# EAGLE design PhatStats Slim Enclosure ESP PCB v0.96 (EAGLE 7.6.0)
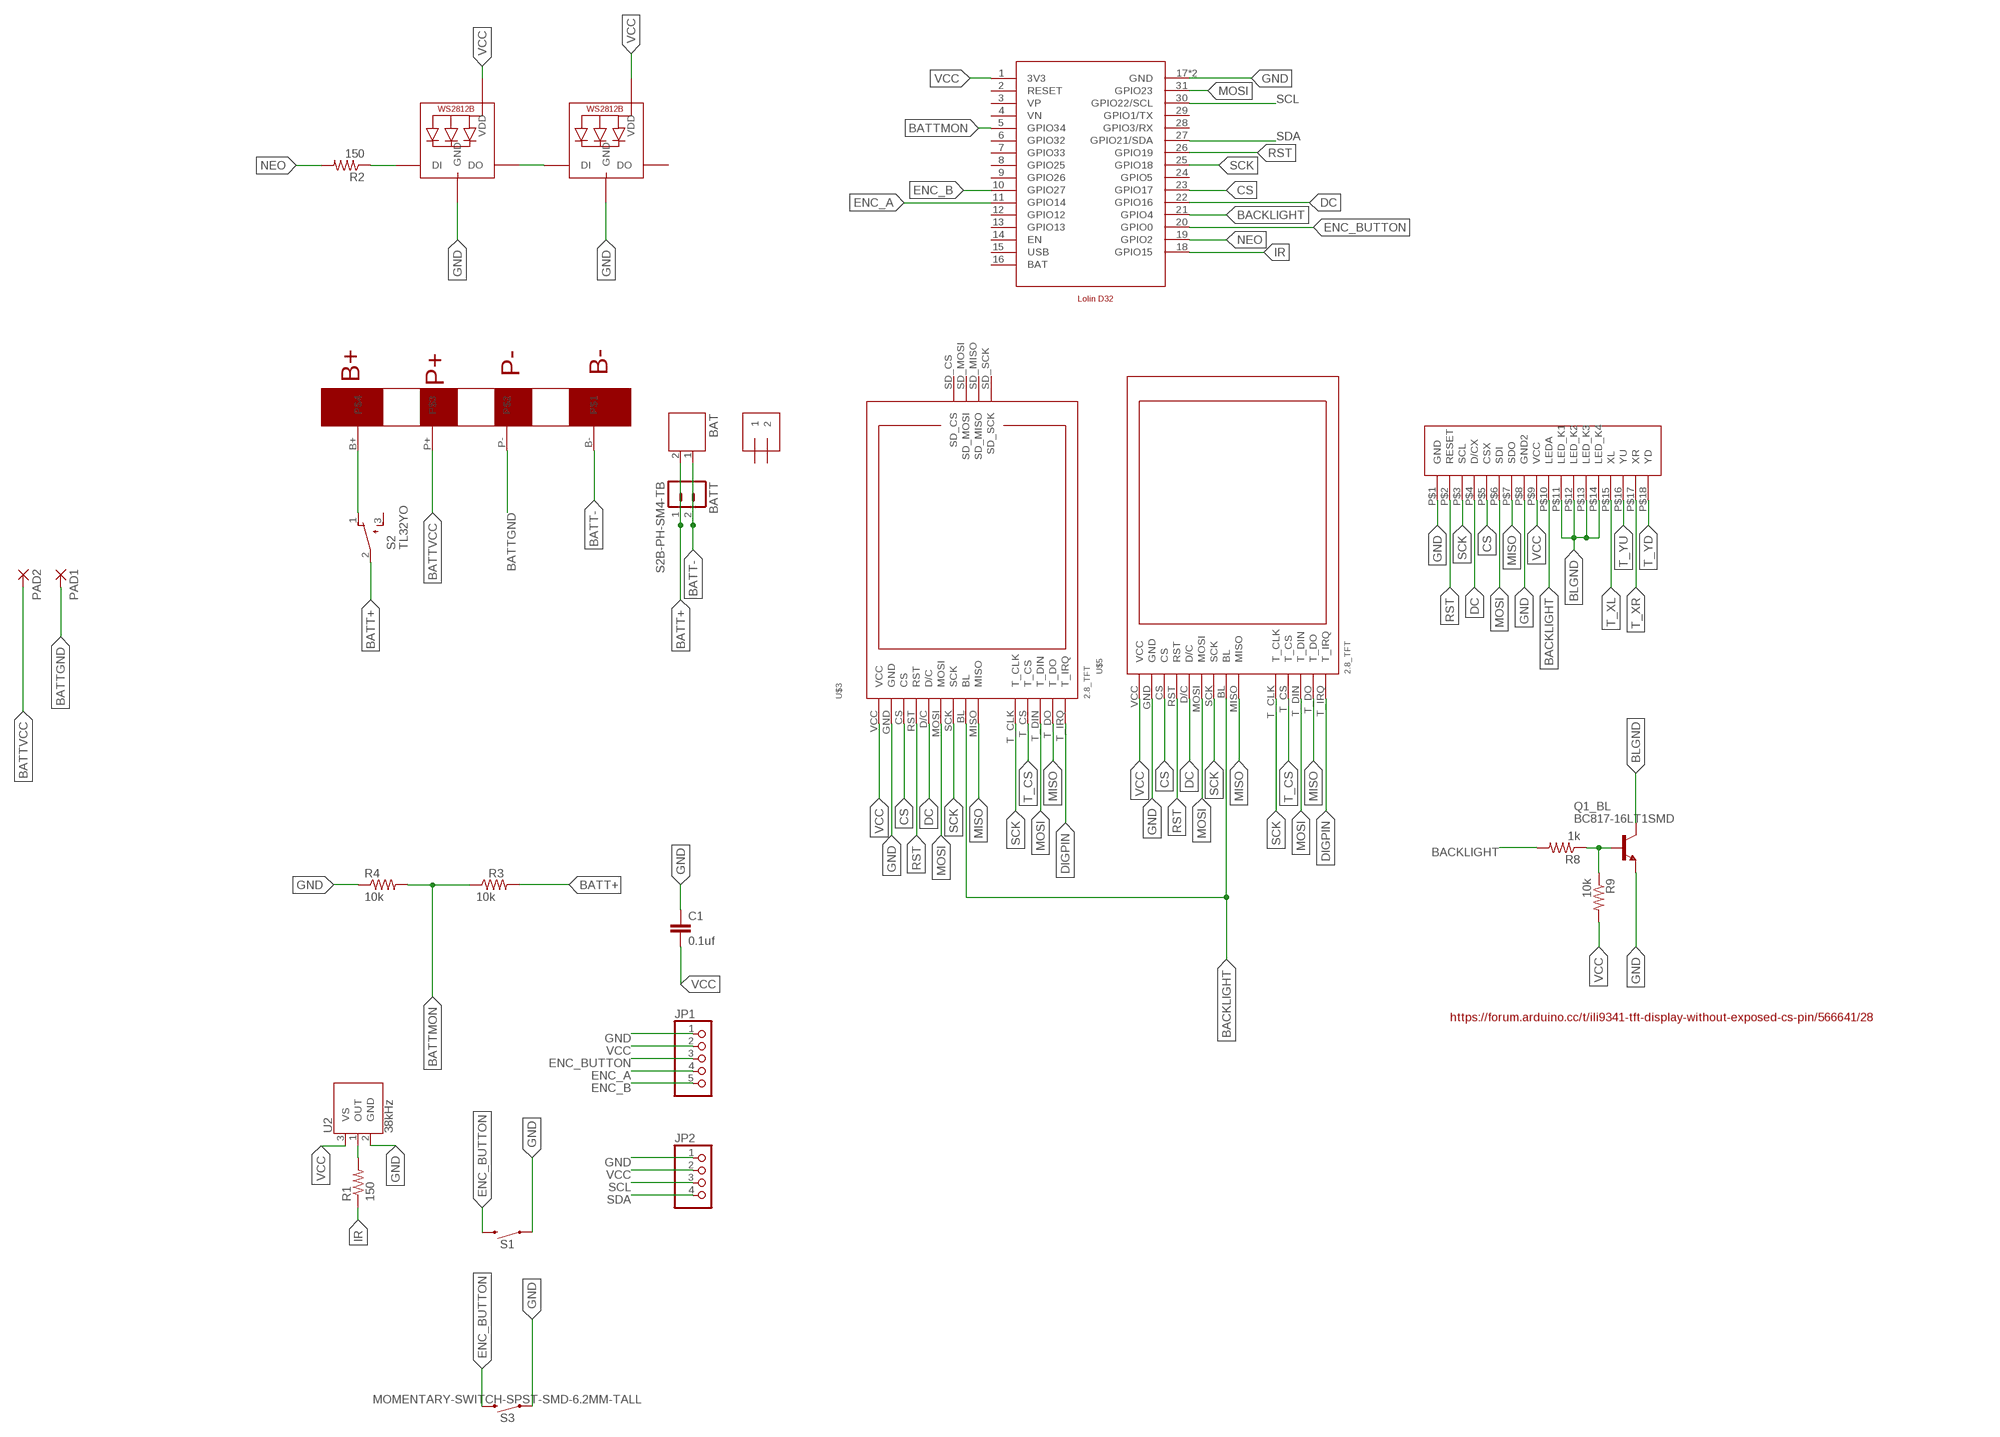
[diagram p0: schematic, sheet 1]

## Parts
0  ILI9341-2.8  [ILI9341-2.8]
BAT  JST-PH2  [JST-PH2]
BATT  S2B-PH-SM4-TB  [S2B-PH-SM4-TB]
BMS  DW01BATTERYPROT  [DW01BATTERYPROT]
C1  0.1uf  C-EUC1206  [C1206]
J1  1X2-3.5MM  [1X2-3.5MM]
JP1  PINHD-1X5  [1X05]
JP2  PINHD-1X4  [1X04]
NEO1  WS2812B5050  [WS2812B]
NEO2  WS2812B5050  [WS2812B]
PAD1  WIREPADSMD5-1,8  [5-1,8]
PAD2  WIREPADSMD5-1,8  [5-1,8]
Q1_BL  BC817-16LT1SMD  [SOT23-BEC]
R1  150  R-US_M1206  [M1206]
R2  150  R-US_M1206  [M1206]
R3  10k  R-US_M1206  [M1206]
R4  10k  R-US_M1206  [M1206]
R8  1k  R-US_M1206  [M1206]
R9  10k  R-US_M1206  [M1206]
S1  MOMENTARY-SWITCH-SPST-PTH-6.0MM  [TACTILE_SWITCH_PTH_6.0MM]
S2  TL32YO  [TL3XYO]
S3  MOMENTARY-SWITCH-SPST-SMD-6.2MM-TALL  [TACTILE_SWITCH_SMD_6.2MM_TALL]
U2  38kHz  TSOP38238  [TSOP382]
U$2  LOLIND32  [LOLIND32]
U$3  2.8_TFT  [2.8_TFT]
U$5  2.8_TFT  [2.8_TFT]

## Nets
BACKLIGHT: 0.P$10(LEDA) R8.2 U$2.21(GPIO4) U$3.BL U$5.BL
BATT+: BAT.2 BATT.1 R3.2 S2.2(P)
BATT-: BAT.1 BATT.2 BMS.B-
BATTGND: BMS.P- PAD1.1(P)
BATTMON: R3.1 R4.2 U$2.5(GPIO34)
BATTVCC: BMS.P+ PAD2.1(P)
BLGND: 0.P$11(LED_K1) 0.P$12(LED_K2) 0.P$13(LED_K3) 0.P$14(LED_K4) Q1_BL.C
CS: 0.P$5(CSX) U$2.23(GPIO17) U$3.CS U$5.CS
DC: 0.P$4(D/CX) U$2.22(GPIO16) U$3.D/C U$5.D/C
DIGPIN: U$3.T_IRQ U$5.T_IRQ
ENC_A: JP1.4 U$2.11(GPIO14)
ENC_B: JP1.5 U$2.10(GPIO27)
ENC_BUTTON: JP1.3 S1.3 S3.B2 U$2.20(GPIO0)
GND: 0.P$1(GND) 0.P$8(GND2) C1.1 JP1.1 JP2.1 NEO1.3-GND(GND) NEO2.3-GND(GND) Q1_BL.E R4.1 S1.1 S3.A2 U2.2(GND) U$2.17(GND) U$2.32(GND) U$3.GND U$5.GND
IR: R1.1 U$2.18(GPIO15)
MISO: 0.P$7(SDO) U$3.MISO U$3.T_DO U$5.MISO U$5.T_DO
MOSI: 0.P$6(SDI) U$2.31(GPIO23) U$3.MOSI U$3.T_DIN U$5.MOSI U$5.T_DIN
N$1: BMS.B+ S2.1(O)
N$2: NEO1.2-DOUT(DO) NEO2.4-DIN(DI)
N$3: R1.2 U2.1(OUT)
N$4: NEO1.4-DIN(DI) R2.1
N$7: Q1_BL.B R8.1 R9.1
NEO: R2.2 U$2.19(GPIO2)
RST: 0.P$2(RESET) U$2.26(GPIO19) U$3.RST U$5.RST
SCK: 0.P$3(SCL) U$2.25(GPIO18) U$3.SCK U$3.T_CLK U$5.SCK U$5.T_CLK
SCL: JP2.3 U$2.30(GPIO22/SCL)
SDA: JP2.4 U$2.27(GPIO21/SDA)
T_CS: U$3.T_CS U$5.T_CS
T_XL: 0.P$15(XL)
T_XR: 0.P$17(XR)
T_YD: 0.P$18(YD)
T_YU: 0.P$16(YU)
VCC: 0.P$9(VCC) C1.2 JP1.2 JP2.2 NEO1.1-VDD(VDD) NEO2.1-VDD(VDD) R9.2 U2.3(VS) U$2.1(3V3) U$3.VCC U$5.VCC
Unconnected: J1.1 J1.2 NEO2.2-DOUT(DO) S2.3(S) U$2.2(RESET) U$2.3(VP) U$2.4(VN) U$2.6(GPIO32) U$2.7(GPIO33) U$2.8(GPIO25) U$2.9(GPIO26) U$2.12(GPIO12) U$2.13(GPIO13) U$2.14(EN) U$2.24(GPIO5) U$2.28(GPIO3/RX) U$2.29(GPIO1/TX) U$3.SD_CS U$3.SD_MISO U$3.SD_MOSI U$3.SD_SCK

## Notes on the sheet
- https://forum.arduino.cc/t/ili9341-tft-display-without-exposed-cs-pin/566641/28

## Power pins joined to a net without a drawn wire
BAT: U$2.16(BAT)
USB: U$2.15(USB)

## Library data of the parts
0 = TML_ili9341_0.8Pitch_Header:ILI9341-2.8
BAT = jst-ph:JST-PH2
BATT = con-JST PH:S2B-PH: JST PH series header 2.00mm pitch disconnectable crimp style connectors, horizontal (side entry type), 2 pins
BMS = TML_DW01_BatteryProtectionModule2:DW01BATTERYPROT
C1 = rcl:C-EU: CAPACITOR, European symbol; SPICEPREFIX: C
J1 = adafruit:1X2: 3.5mm Terminal block http://www.ladyada.net/library/pcb/eaglelibrary.html
JP1 = pinhead:PINHD-1X5: PIN HEADER
JP2 = pinhead:PINHD-1X4: PIN HEADER
NEO1 NEO2 = adafruit:WS2812B
PAD1 PAD2 = wirepad:WIREPAD: Wire PAD connect wire on PCB
Q1_BL = transistor-npn:BC817*: NPN Transistor
R1-R4 R8 R9 = resistor:R-US_: RESISTOR, American symbol
S1 = SparkFun-Switches:MOMENTARY-SWITCH-SPST: Momentary Switch (Pushbutton) - SPST Normally-open (NO) SPST momentary switches (buttons, pushbuttons). Variants PTH-12MM - 12mm square, through-hole Momentary Pushbutton Switch - 12mm Square <https://www.sparkfun.com/products/9190> (COM-09190) PTH-6.0MM, PTH-6.0MM-KIT - 6.0mm square, through-hole Mini Pushbutton Switch <https://www.sparkfun.com/products/97> (COM-00097) KIT package intended for soldering kit's - only one side of pads' copper is exposed. PTH-RIGHT-ANGLE-KIT - Right-angle, through-hole Right Angle Tactile Button <https://www.sparkfun.com/products/10791> - Used on SparkFun BigTime Watch Kit <https://www.sparkfun.com/products/11734> SMD-12MM - 12mm square, surface-mount Tactile Button - SMD (12mm) <https://www.sparkfun.com/products/12993> (COM-12993) Used on SparkFun PicoBoard <https://www.sparkfun.com/products/11888> SMD-4.5MM - 4.5mm Square Trackball Switch Used on SparkFun Blackberry Trackballer Breakout <https://www.sparkfun.com/products/13169> SMD-4.6MMX2.8MM - 4.60mm x 2.80mm, surface mount Used on SparkFun SAMD21 Mini Breakout <https://www.sparkfun.com/products/13664> SMD-5.2MM, SMD-5.2-REDUNDANT - 5.2mm square, surface-mount Mini Pushbutton Switch - SMD <https://www.sparkfun.com/products/8720> (COM-08720) Used on Arduino Pro Mini <https://www.sparkfun.com/products/11114> REDUNDANT package connects both switch circuits together SMD-6.0X3.5MM - 6.0 x 3.5mm, surface mount Momentary Reset Switch SMD <https://www.sparkfun.com/products/8229> (COM-08229) SMD-6.2MM-TALL - 6.2mm square, surface mount Tactile Button - SMD (6mm) <https://www.sparkfun.com/products/12992> Used on SparkFun Digital Sandbox <https://www.sparkfun.com/products/12651> SMD-RIGHT-ANGLE - Right-angle, surface mount Used on SparkFun Block for Intel® Edison - Arduino <https://www.sparkfun.com/products/13036>; PROD_ID: SWCH-08441; SF_SKU: COM-00097
S2 = switch:TL32YO: TINY SWITCH ON - MOM Source: http://www2.produktinfo.conrad.com/datenblaetter/700000-724999/705152-da-01-de-Subminiaturschalter_TL_36YO.pdf
S3 = SparkFun-Switches:MOMENTARY-SWITCH-SPST: Momentary Switch (Pushbutton) - SPST Normally-open (NO) SPST momentary switches (buttons, pushbuttons). Variants PTH-12MM - 12mm square, through-hole Momentary Pushbutton Switch - 12mm Square <https://www.sparkfun.com/products/9190> (COM-09190) PTH-6.0MM, PTH-6.0MM-KIT - 6.0mm square, through-hole Mini Pushbutton Switch <https://www.sparkfun.com/products/97> (COM-00097) KIT package intended for soldering kit's - only one side of pads' copper is exposed. PTH-RIGHT-ANGLE-KIT - Right-angle, through-hole Right Angle Tactile Button <https://www.sparkfun.com/products/10791> - Used on SparkFun BigTime Watch Kit <https://www.sparkfun.com/products/11734> SMD-12MM - 12mm square, surface-mount Tactile Button - SMD (12mm) <https://www.sparkfun.com/products/12993> (COM-12993) Used on SparkFun PicoBoard <https://www.sparkfun.com/products/11888> SMD-4.5MM - 4.5mm Square Trackball Switch Used on SparkFun Blackberry Trackballer Breakout <https://www.sparkfun.com/products/13169> SMD-4.6MMX2.8MM - 4.60mm x 2.80mm, surface mount Used on SparkFun SAMD21 Mini Breakout <https://www.sparkfun.com/products/13664> SMD-5.2MM, SMD-5.2-REDUNDANT - 5.2mm square, surface-mount Mini Pushbutton Switch - SMD <https://www.sparkfun.com/products/8720> (COM-08720) Used on Arduino Pro Mini <https://www.sparkfun.com/products/11114> REDUNDANT package connects both switch circuits together SMD-6.0X3.5MM - 6.0 x 3.5mm, surface mount Momentary Reset Switch SMD <https://www.sparkfun.com/products/8229> (COM-08229) SMD-6.2MM-TALL - 6.2mm square, surface mount Tactile Button - SMD (6mm) <https://www.sparkfun.com/products/12992> Used on SparkFun Digital Sandbox <https://www.sparkfun.com/products/12651> SMD-RIGHT-ANGLE - Right-angle, surface mount Used on SparkFun Block for Intel® Edison - Arduino <https://www.sparkfun.com/products/13036>; PROD_ID: SWCH-11966; SF_SKU: COM-12992
U2 = SparkFun-Sensors:TSOP382: Vishay Semiconductor TSOP32838 - 38kHz IR Receiver These products are miniaturized IR receiver modules for infrared remote control systems. A PIN diode and a preamplifier are assembled on a leadframe, the epoxy package contains an IR filter. The demodulated output signal can be directly connected to a microprocessor for decoding.; PROD_ID: SEN-10266
U$2 = TML_Wemos Loloin D32 ESP32 Round:LOLIND32: Wemos Lolin D32 Lolin D32 is a development board based on ESP32. On this schematic, this board is designed with battery port. Pins VP and VN are Not Connected pins.
U$3 = TML_ili9341-2.8_tft-display_Corrected:2.8_TFT: ILI9341 2.8" 2.8 inch TFT SPI Touch Panel 240X320 http://www.lcdwiki.com/2.8inch_SPI_Module_ILI9341_SKU:MSP2807 http://www.lcdwiki.com/Run_Arduino_Demo_in_spi_model
U$5 = TML_ili9341-2.8_tft-display_PinHeader only:2.8_TFT: ILI9341 2.8" 2.8 inch TFT SPI Touch Panel 240X320 http://www.lcdwiki.com/2.8inch_SPI_Module_ILI9341_SKU:MSP2807 http://www.lcdwiki.com/Run_Arduino_Demo_in_spi_model

## Board
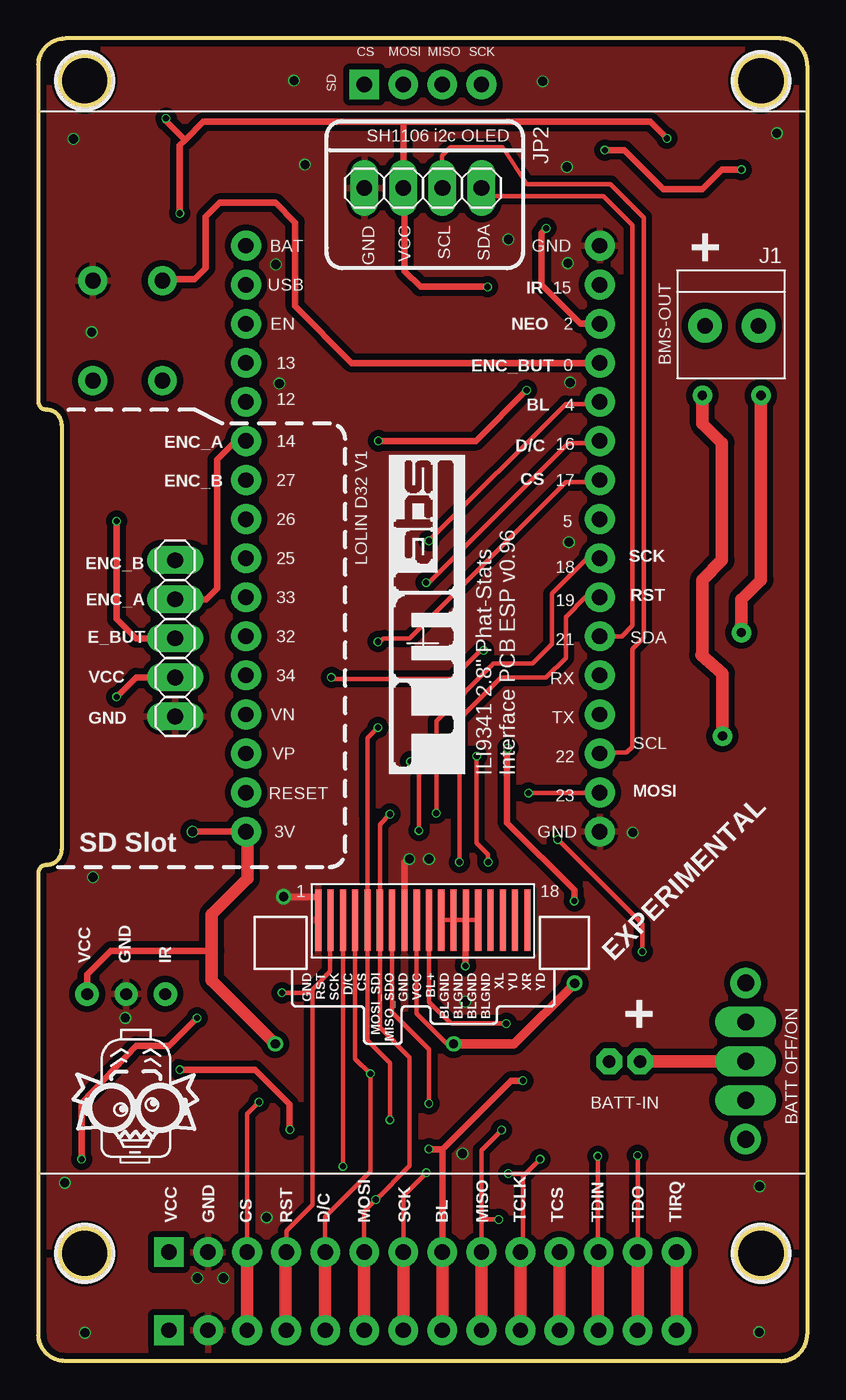
[diagram p1: board, top side]
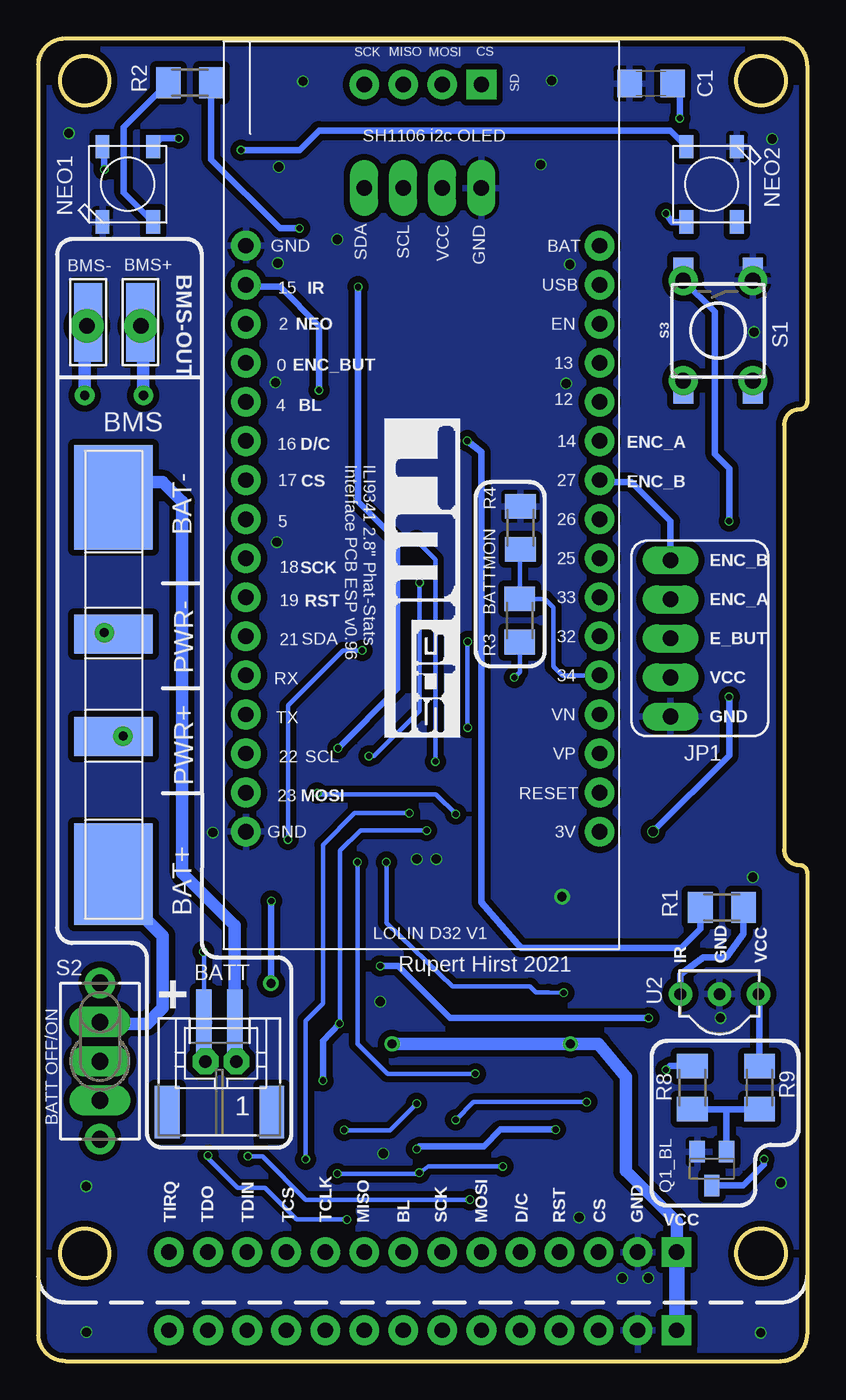
[diagram p2: board, bottom side, seen from below]

Size 50 x 86 mm. Coordinates in mm from the lower left corner, seen from the top.
Outline: 50,84.27 50,1.73 arc-90 48.27,0 1.73,0 arc-90 0,1.73 0,31.75 arc-90 0.5,32.25 arc90 1.5,33.25 1.5,60.88 arc90 0.5,61.88 arc-90 0,62.38 0,84.27 arc-90 1.73,86 48.27,86 arc-90 50,84.27
Outline: circle at 47,83.25 radius 1.6
Outline: circle at 47,7 radius 1.6
Outline: circle at 3,83.25 radius 1.6
Outline: circle at 3,7 radius 1.6
Copper layers (1*16): Top 0.035mm / dielectric 1.6mm / Bottom 0.035mm
Design rules "jlcpcb-2layers": minimum track width 5mil, minimum drill 0.3mm, track to track 5mil, track to pad 5mil, pad to pad 5mil, via to via 5mil, smd to smd 5mil, copper to edge 0.2mm, drill to drill 6mil, minimum pad ring 10mil, minimum via ring 3mil, stop-mask expansion 4mil, vias tented up to drill 0mil, thermal gap 10mil

### Footprints (pad centres in the part's own frame; a part is rotated, then mirrored left to right if it is on the bottom)
ILI9341-2.8 = smd 4 x 0.4: P$1 -18,6.8; P$2 -18,6; P$3 -18,5.2; P$4 -18,4.4; P$5 -18,3.6; P$6 -18,2.8; P$7 -18,2; P$8 -18,1.2; P$9 -18,0.4; P$10 -18,-0.4; P$11 -18,-1.2; P$12 -18,-2; P$13 -18,-2.8; P$14 -18,-3.6; P$15 -18,-4.4; P$16 -18,-5.2; P$17 -18,-6; P$18 -18,-6.8
JST-PH2 = drill 0.813 pad 1.676 octagon: 1 1,0; 2 -1,0
S2B-PH-SM4-TB = smd 1 x 4.5: 1 1,0; 2 -1,0 | smd 1.6 x 3.4: M1 3.4,5.75; M2 -3.4,5.75
DW01BATTERYPROT = smd 5.08 x 2.54: B+ 3.175,29.15; B+1 3.175,26.745; B+2 3.175,6.405; B+3 3.175,30.805; B- 3.175,4.31; B-1 3.175,2.155; P+ 3.175,19.839; P- 3.175,13.154
C1206 = smd 1.6 x 1.8: 1 -1.4,0; 2 1.4,0
1X2-3.5MM = drill 1 pad 2.184: 1 1.8,0; 2 -1.7,0
1X05 = drill 1.016 long: 1 -5.08,0; 2 -2.54,0; 3 0,0; 4 2.54,0; 5 5.08,0
1X04 = drill 1.016 long: 1 -3.81,0; 2 -1.27,0; 3 1.27,0; 4 3.81,0
WS2812B = smd 1.5 x 0.9: 1-VDD 2.45,-1.65; 2-DOUT 2.45,1.65; 3-GND -2.45,1.65; 4-DIN -2.45,-1.65
5-1,8 = smd 1.829 x 5.08: 1 0,0
SOT23-BEC = smd 1 x 1.4: B -0.95,-1.1; C 0,1.1; E 0.95,-1.1
M1206 = smd 1.6 x 2: 1 -1.4,0; 2 1.4,0
TACTILE_SWITCH_PTH_6.0MM = drill 1.016 pad 1.88: 1 -3.251,2.261; 2 3.251,2.261; 3 -3.251,-2.261; 4 3.251,-2.261
TL3XYO = drill 1.1 pad 1.422 long: 1 -2.54,0; 2 0,0; 3 2.54,0 | drill 1.1 pad 1.676: M1 -5.08,0; M2 5.08,0
TACTILE_SWITCH_SMD_6.2MM_TALL = smd 1.55 x 1.3: A1 -3.975,-2.25; A2 3.975,-2.25; B1 -3.975,2.25; B2 3.975,2.25
TSOP382 = drill 0.762 pad 1.524: 1 -2.54,0; 2 0,0; 3 2.54,0
LOLIND32 = drill 1 pad 1.93: 1 -11.43,21.59; 2 -11.43,19.05; 3 -11.43,16.51; 4 -11.43,13.97; 5 -11.43,11.43; 6 -11.43,8.89; 7 -11.43,6.35; 8 -11.43,3.81; 9 -11.43,1.27; 10 -11.43,-1.27; 11 -11.43,-3.81; 12 -11.43,-6.35; 13 -11.43,-8.89; 14 -11.43,-11.43; 15 -11.43,-13.97; 16 -11.43,-16.51; 17 11.58,-16.51; 18 11.58,-13.97; 19 11.58,-11.43; 20 11.58,-8.89; 21 11.58,-6.35; 22 11.58,-3.81; 23 11.58,-1.27; 24 11.58,1.27; 25 11.58,3.81; 26 11.58,6.35; 27 11.58,8.89; 28 11.58,11.43; 29 11.58,13.97; 30 11.58,16.51; 31 11.58,19.05; 32 11.58,21.59
2.8_TFT = drill 1 pad 1.93: BL 26.27,2; CS 13.57,2; D/C 18.65,2; GND 11.03,2; MISO 28.81,2; MOSI 21.19,2; RST 16.11,2; SCK 23.73,2; SD_MISO 26.27,83; SD_MOSI 23.73,83; SD_SCK 28.81,83; T_CLK 31.35,2; T_CS 33.89,2; T_DIN 36.43,2; T_DO 38.97,2; T_IRQ 41.51,2 | drill 1 pad 1.93 square: SD_CS 21.19,83; VCC 8.49,2
2.8_TFT' = drill 1 pad 1.93: BL 26.27,2; CS 13.57,2; D/C 18.65,2; GND 11.03,2; MISO 28.81,2; MOSI 21.19,2; RST 16.11,2; SCK 23.73,2; T_CLK 31.35,2; T_CS 33.89,2; T_DIN 36.43,2; T_DO 38.97,2; T_IRQ 41.51,2 | drill 1 pad 1.93 square: VCC 8.49,2

### Placement (x,y rotation side)
0  25,46.68 90 top
BAT  38.13,19.48 0 bottom
BATT  38.23,21.93 180 bottom
BMS  41.95,60.44 180 bottom
C1  10.16,83.07 0 bottom
J1  45.15,67.31 180 top
JP1  8.89,46.99 90 top
JP2  25.01,76.27 0 top
NEO1  44.19,76.52 90 bottom
NEO2  6.22,76.52 270 bottom
PAD1  46.76,67.54 0 bottom
PAD2  43.37,67.54 0 bottom
Q1_BL  6.21,12.51 180 bottom
R1  5.55,29.49 0 bottom
R2  40.16,83.12 0 bottom
R3  18.7,48.16 270 bottom
R4  18.66,54.17 270 bottom
R8  7.47,17.78 90 bottom
R9  3.1,17.78 90 bottom
S1  5.8,67 270 bottom
S2  46,19.5 270 bottom
S3  5.8,67 90 bottom
U2  5.71,23.86 0 bottom
U$2  24.93,56.02 180 bottom
U$3  0,0 0 top
U$5  2.8_TFT  [2.8_TFT']  0,5.08 0 top
U$6  [MADPROF]  4.05,12.62 0 top
U$9  [TMSLOGO_INVERTED]  28.85,61.91 270 bottom
U$10  [TMSLOGO_INVERTED]  29.08,37.54 90 top

### Tracks (layer width: path | path; a pad name or v marks a point on that pad's centre or on a via)
BACKLIGHT  (via drill 0.4)
  Top 0.305: 0.P$10 25.4,23.37 26.82,21.95 v30.42,21.95 | v24.75,34.5 24.75,38.42 v24.19,38.98 | U$2.21 36.38,62.23 34.29,62.23 v25.4,53.34
  Top 0.406: U$5.BL 26.27,13.76 | v31.5,18.23 30.74,18.23 26.27,13.76 | v9.19,18.94 14.08,18.94 16.32,16.7 16.32,15.28 v16.36,15.05 | 26.27,13.76 25.8,13.76 v25.4,13.78
  Top 0.813: U$5.BL U$3.BL
  Bottom 0.305: v30.42,21.95 30.38,22.12 30.38,33.19 29.06,34.5 v24.75,34.5 | v24.19,38.98 24.19,52.13 v25.4,53.34
  Bottom 0.406: v30.42,21.95 31.5,20.81 v31.5,18.23 | R8.2 8.95,19.18 v9.19,18.94 | v25.4,13.78 25.21,13.97 21.03,13.97 19.95,15.05 v16.36,15.05
BATT+  (via drill 0.4)
  Top 0.305: v39.27,26.62 39.27,28.41 v33.77,33.91 | v28.95,46.21 28.76,46.21 26.89,44.34 19.16,44.34 v19.05,44.45
  Top 0.813: S2.2 39.15,19.5 BAT.2
  Bottom 0.305: v39.27,26.62 39.23,26.62 BATT.1 | v33.77,33.92 v33.77,33.91 33.77,42.62 30.18,46.21 v28.95,46.21 | v19.05,44.45 18.7,44.8 R3.2
  Bottom 0.406: 18.38,46.7 R3.2
  Bottom 0.813: BATT.1 39.11,22.01 | 39.34,22.04 BATT.1 | BAT.2 39.13,21.83 BATT.1
BATT-
  Bottom 0.406: BAT.1 37.23,20.79 BATT.2
  Bottom 0.813: 37.31,21.94 37.31,21.93 BATT.2 37.23,28.34 40.64,31.75 40.64,55.88 41.91,57.15 44.88,57.15 BMS.B-
BATTGND  (via drill 0.6 pad 1.27)
  Top 0.813: v45.72,47.37 45.72,49.53 46.99,50.8 v46.99,62.79
  Bottom 0.305: BMS.P- 45.64,47.29 v45.72,47.37
  Bottom 0.813: v46.99,62.79 46.99,66.75 PAD1.1
BATTMON
  Bottom 0.305: 18.38,52.69 18.37,52.68 R4.2 18.7,52.44 R3.1 17.06,49.56 16.51,49.01 16.51,45.16 15.94,44.59 U$2.5
BATTVCC  (via drill 0.6 pad 1.27)
  Top 0.813: v44.49,40.64 44.49,44.72 43.12,45.9 43.18,45.9 43.18,50.8 44.45,52.07 44.45,59.69 43.18,60.96 v43.18,62.79
  Bottom 0.813: BMS.P+ 44.49,40.6 v44.49,40.64 | v43.18,62.79 43.18,67.35 PAD2.1
BLGND  (via drill 0.4)
  Top 0.305: 0.P$14 0.P$13 0.P$12 0.P$11
  Top 0.406: 0.P$13 27.77,28.68 v27.77,25.69 | v2.81,13.12 2.81,16.78 6.35,20.51 8.51,20.51 v10.31,22.31
  Bottom 0.406: Q1_BL.C 4.15,11.41 2.81,12.75 v2.81,13.12 | v10.31,22.31 23.25,22.31 26.62,25.69 v27.77,25.69
CS  (via drill 0.4)
  Top 0.305: v22.86,15.68 22.86,19.38 21.4,20.84 0.P$5 21.41,35.38 21.41,40.51 v22.08,41.19 | U$5.CS 13.57,16.07 v14.35,16.84 | U$2.23 36.38,57.15 34.29,57.15 24.13,46.99 22.48,46.99 v22.08,46.77
  Top 0.813: U$3.CS U$5.CS
  Bottom 0.305: v14.35,16.84 21.69,16.84 v22.86,15.68 | v22.08,41.19 v22.08,46.77
DC  (via drill 0.4)
  Top 0.305: 0.P$4 20.6,19.66 v21.59,18.68 21.59,12.32 18.65,9.38 U$5.D/C | v29.25,32.44 29.25,32.94 28.5,33.69 v28.5,39.34 | v25.21,50.61 25.4,50.61 34.48,59.69 36.38,59.69 U$2.22
  Top 0.813: U$3.D/C U$5.D/C
  Bottom 0.305: v21.59,18.68 27.3,18.68 29.25,20.62 v29.25,32.44 | v25.21,50.61 25.21,42.28 28.16,39.34 v28.5,39.34
DIGPIN
  Top 0.813: U$3.T_IRQ U$5.T_IRQ
ENC_A
  Top 0.406: JP1.4 10.91,49.53 11.62,50.24 11.62,58.61 12.7,59.69 13.37,59.69 U$2.11
ENC_B
  Bottom 0.406: JP1.5 8.89,54.61 11.43,57.15 13.37,57.15 U$2.10
ENC_BUTTON  (via drill 0.4)
  Top 0.406: JP1.3 6.35,46.99 5.08,48.26 v5.08,54.61 | U$2.20 20.37,64.91 16.7,68.58 16.7,74.03 15.43,75.31 11.78,75.31 10.88,74.4 10.88,71.07 10.16,70.35 8.12,70.35 S1.3
  Bottom 0.406: v5.08,54.61 5.08,58.04 6,58.96 6,68.23 S1.3 | 8.06,70.29 S1.3 | S1.3 8.09,71 S3.B2
GND  (via drill 0.6, 0.6 pad 1)
  Top 0.406: 0.P$1 18.21,30.18 v15.95,30.19 | 0.P$8 23.8,32.46 v24.13,32.65
  other vias: 46.88,1.88 1.71,11.59 3.02,1.84 12.03,5.4 3.46,66.9 48.02,79.84 2.27,79.47 3.54,31.46 14.84,9.34 10.34,5.4 5.64,22.32 32.8,83.22 27.77,23.37 46.89,11.36 38.66,34.37 27.58,13.49 34.5,53.25 34.58,63.62 30.56,72.94 16.62,83.26 15.67,63.56 15.44,71.31 17.33,77.8 34.37,77.64 25.4,32.65 34.43,71.39
  pour Bottom (isolate 0.406): -1.27,-1.27 -1.27,87.63 50.8,87.63 50.8,-1.27
  pour Top (isolate 0.406): 52.07,-2.54 52.07,88.9 -2.54,88.9 -2.54,-2.54
IR  (via drill 0.4)
  Top 0.406: v22.11,59.84 28.46,59.84 v31.75,63.12
  Bottom 0.406: R1.1 6.95,28.11 8.19,26.88 18.62,26.88 21.19,29.81 21.19,59.1 v22.11,59.84 | v31.75,63.12 31.75,67.31 34.29,69.85 36.38,69.85 U$2.18
MISO  (via drill 0.4)
  Top 0.305: 0.P$7 23,22.68 25.4,20.28 v25.4,16.74 | 28.81,9 U$5.MISO | v29.93,9.21 28.98,9.21 28.81,9 | U$5.T_DO v38.97,13.37 | 28.81,9 28.81,13.71 v30.12,15.02
  Top 0.813: U$3.MISO U$5.MISO | U$3.T_DO U$5.T_DO
  Bottom 0.305: v30.12,15.02 27.12,15.02 v25.4,16.74 | v29.93,9.21 33.2,9.21 35.25,11.25 37.03,11.25 38.97,13.19 v38.97,13.37
MOSI  (via drill 0.4)
  Top 0.305: U$3.T_DIN 36.38,2 | U$5.T_DIN 36.38,7.08 v36.38,13.31 | U$5.MOSI 21.19,7.26 21.19,9.75 22.13,10.69 v21.94,10.5 24.13,12.69 24.13,19.76 22.2,21.69 0.P$6 22.2,34.69 22.2,34.9 v22.86,35.56 | v31.88,36.94 35.98,36.94 36.5,36.95 U$2.31
  Top 0.813: U$3.MOSI U$5.MOSI | 36.38,2 36.38,7.03 U$5.T_DIN
  Bottom 0.305: v21.94,10.5 32.62,10.5 35.44,13.31 v36.38,13.31 | v22.86,35.56 24.13,36.83 31.75,36.83 31.76,36.82 v31.88,36.94
N$1
  Bottom 0.813: 46.84,31.7 46.43,31.91 BMS.B+ | 45,31.16 BMS.B+ | BMS.B+ 45.19,31.23 45.38,31.12 41.91,27.66 41.91,22.96 42.94,21.94 45.9,21.94 S2.1
  Bottom 1.016: 43.14,30.97 46.43,31.91
N$2  (via drill 0.4)
  Top 0.406: v45.72,77.47 44.45,77.47 43.18,76.2 40.64,76.2 38.1,78.74 v36.83,78.74
  Bottom 0.406: NEO1.2-DOUT 45.72,78.97 v45.72,77.47 | NEO2.4-DIN 8.91,80.01 31.75,80.01 33.02,78.74 v36.83,78.74
N$3
  Bottom 0.406: U2.1 8.24,25.13 6.75,26.25 5.25,26.25 4.15,27.79 R1.2
N$4
  Bottom 0.406: NEO1.4-DIN 44.45,75.98 44.45,80.22 R2.1
N$7
  Bottom 0.406: R9.1 5.27,16.38 | 5.27,16.38 R8.1 | 5.27,16.38 5.27,13.62 Q1_BL.B
NEO  (via drill 0.4)
  Top 0.406: U$2.19 35.24,67.44 32.7,69.98 32.7,73.34 v33.02,73.66
  Bottom 0.406: v33.02,73.66 34.29,73.66 38.76,78.12 R2.2
RST  (via drill 0.4)
  Top 0.254: 16.11,2.02 16.09,2
  Top 0.305: U$3.RST 16.09,2 | 0.P$2 18.98,25.32 17.82,24.16 | 16.14,7.25 16.12,7.12 U$5.RST 16.12,7.47 16.12,8.48 17.82,10.17 17.82,24.16 | v27.38,32.44 27.38,41.75 30.07,44.45 33.02,44.45 34.29,45.72 34.29,48.4 35.56,49.66 U$2.26 | v15.84,23.95 17.6,23.95 17.82,24.16
  Top 0.813: 16.09,2 16.09,7.06 U$5.RST
  Bottom 0.305: v27.38,32.44 27.38,28.5 23.06,24.38 18.03,24.38 17.64,23.98 16.81,23.98 v15.84,23.95
SCK  (via drill 0.4)
  Top 0.305: 0.P$3 v19.8,12.66 | U$5.SCK 23.73,10.75 v25.23,12.25 | v32.62,13.12 31.69,12.19 31.5,12.19 | 31.5,12.19 v30.56,12.19 | U$5.T_CLK 31.5,7.08 31.5,12.19 | v25.88,35.62 25.88,41.63 29.59,45.34 32.12,45.34 33.4,46.62 33.4,49.91 35.56,52.07 36.38,52.07 U$2.25
  Top 0.813: U$3.SCK U$5.SCK | U$3.T_CLK U$5.T_CLK
  Bottom 0.305: v25.88,35.62 29.44,35.62 31.5,33.56 31.5,23.25 32.62,22.12 v32.62,13.12 | v30.56,12.19 25.17,12.19 v25.23,12.25 24.63,12.66 v19.8,12.66
SCL
  Top 0.305: JP2.3 26.25,76.3 26.25,78.38 26.81,78.94 30.19,78.94 31.78,76.53 37.2,76.53 39.38,74.36 39.38,47.06 38.62,46.31 38.62,39.94 38.25,39.56 36.57,39.56 U$2.30
SDA
  Top 0.305: U$2.27 37.94,47.12 38.62,47.81 38.62,73.88 36.75,75.75 29.34,75.75 JP2.4
T_CS
  Top 0.813: U$3.T_CS U$5.T_CS
T_XL
  Top 0.305: 29.44,28.64 0.P$15
T_YU
  Top 0.305: 30.19,28.67 0.P$16
VCC  (via drill 0.4, 0.6, 0.6 pad 1)
  Top 0.305: 0.P$9 24.6,22.6 26.58,20.62 v27,20.62 | v9.19,74.62 v9.2,74.62
  Top 0.406: U2.3 3.17,25.14 4.7,26.67 11.27,26.67 | v30.52,39.85 30.48,39.8 30.48,35 34.85,30.62 v34.85,29.92 | v29.21,69.85 24.84,69.85 23.81,70.88 23.81,76.2 JP2.2 23.74,80.46 23.62,80.57 | 23.62,80.57 39.8,80.57 v40.88,79.5 | v9.2,74.62 9.2,79.05 9.53,79.38 | 9.53,79.38 10.72,80.57 23.62,80.57 | v8.29,80.81 8.29,80.61 9.53,79.38 | U$2.1 v10.03,34.42 | v5.08,43.18 6.35,44.45 JP1.2
  Top 0.61: v27,20.62 30.94,20.62 v34.88,24.56
  Top 0.813: v15.4,20.62 11.27,24.76 11.27,26.67 11.27,29.05 13.6,31.38 13.6,34.33 U$2.1
  Bottom 0.406: NEO2.1-VDD 8.82,74.07 v9.19,74.62 | v40.88,79.5 42.01,79.5 NEO1.1-VDD | v29.21,69.85 29.21,55.88 26.67,53.34 26.67,43.7 v30.52,39.85 | v34.88,24.56 34.88,29.71 v34.85,29.92 | v8.29,80.81 8.29,82.6 C1.2 | v10.03,34.42 5.08,39.37 v5.08,43.18 | U2.3 3.1,23.8 R9.2
  Bottom 0.61: 8.44,7.5 8.49,7.12 U$5.VCC
  Bottom 0.813: v27,20.62 v15.4,20.62 13.57,20.62 11.8,18.49 11.8,12.37 8.49,9.05 U$5.VCC
  Bottom 1.016: U$3.VCC U$5.VCC

### Text on the board
tPlace: SH1106 i2c OLED | GND | VCC | SCL | SDA | BAT | GND | + | USB | IR | 15 | BMS-OUT | EN | NEO | 2 | 13 | ENC_BUT | 0 | 12 | BL | 4 | 14 | 16 | ENC_A | LOLIN D32 V1 | D/C | 27 | 17 | ENC_B | CS | 26 | 5 | 25 | SCK | 18 | ENC_B | 33 | 19 | RST | ENC_A | 32 | E_BUT | 21 | SDA | 34 | RX | VCC | VN | TX | GND | VP | 22 | SCL | ILI9341 2.8" Phat-Stats / Interface PCB ESP v0.96 | RESET | 23 | MOSI | 3V | GND | SD Slot | VCC | GND | IR | EXPERIMENTAL | GND | RST | SCK | D/C | CS | MOSI_SDI | MISO_SDO | GND | VCC | BL+ | BLGND | BLGND | BLGND | BLGND | XL | YU | XR | YD | + | BATT-IN | BATT OFF/ON | VCC | GND | CS | RST | D/C | MOSI | SCK | BL | MISO | TCLK | TCS | TDIN | TDO | TIRQ
bPlace: SH1106 i2c OLED | GND | VCC | SCL | SDA | BAT | GND | BMS+ | BMS- | BMS-OUT | USB | IR | 15 | EN | NEO | 2 | 13 | ENC_BUT | 0 | 12 | BL | 4 | 14 | 16 | ENC_A | D/C | 27 | ILI9341 2.8" Phat-Stats / Interface PCB ESP v0.96 | CS | 17 | ENC_B | 26 | 5 | 25 | ENC_B | SCK | 18 | 33 | RST | 19 | ENC_A | BATTMON | 32 | E_BUT | SDA | 21 | 34 | RX | VCC | GND | VN | TX | VP | SCL | 22 | RESET | MOSI | 23 | 3V | GND | LOLIN D32 V1 | VCC | GND | IR | Rupert Hirst 2021 | + | BATT OFF/ON | VCC | GND | CS | RST | D/C | MOSI | SCK | BL | MISO | TCLK | TCS | TDIN | TDO | TIRQ